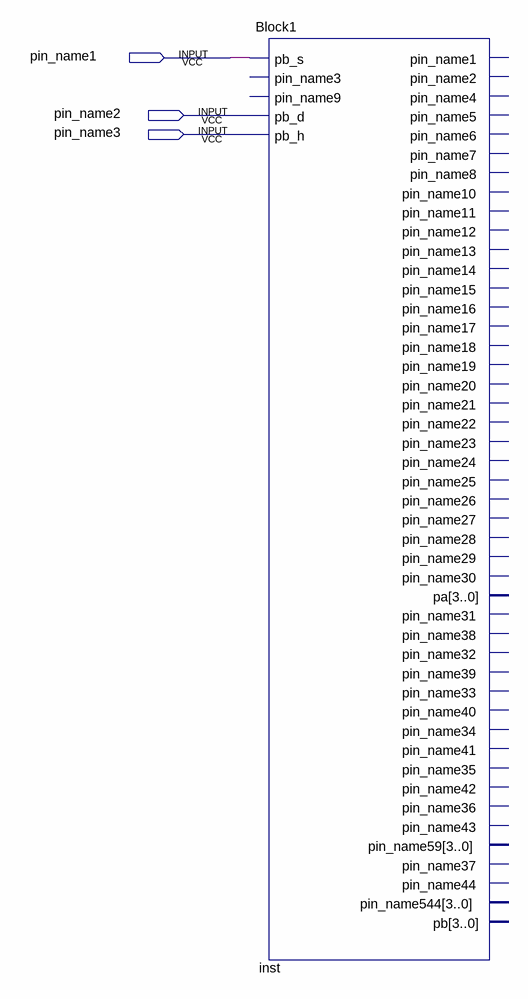
[diagram p0: schematic sheet]
// Quartus schematic D009_20131209_ALARMCLKDDD.bdf as structural Verilog: 1 symbols, 3 pins
module D009_20131209_ALARMCLKDDD (
  input  pin_name1,
  input  pin_name2,
  input  pin_name3
);

  Block1 inst (
    .pb_s(pin_name1), .pb_d(pin_name2), .pb_h(pin_name3));  // open: pin_name3, pin_name9, pin_name1, pin_name2, pin_name4, pin_name5, pin_name6, pin_name7, pin_name8, pin_name10, pin_name11, pin_name12, pin_name13, pin_name14, pin_name15, pin_name16, pin_name17, pin_name18, pin_name19, pin_name20, pin_name21, pin_name22, pin_name23, pin_name24, pin_name25, pin_name26, pin_name27, pin_name28, pin_name29, pin_name30, pa, pin_name31, pin_name38, pin_name32, pin_name39, pin_name33, pin_name40, pin_name34, pin_name41, pin_name35, pin_name42, pin_name36, pin_name43, pin_name59, pin_name37, pin_name44, pin_name544, pb
endmodule
